# EAGLE design ukmarsbot-line-sensor-half-size-V2 (EAGLE 7.7.0)
CNAME: UKMARSBOT; CREVISION: v1.2; DESIGNER: Ian Butterworth
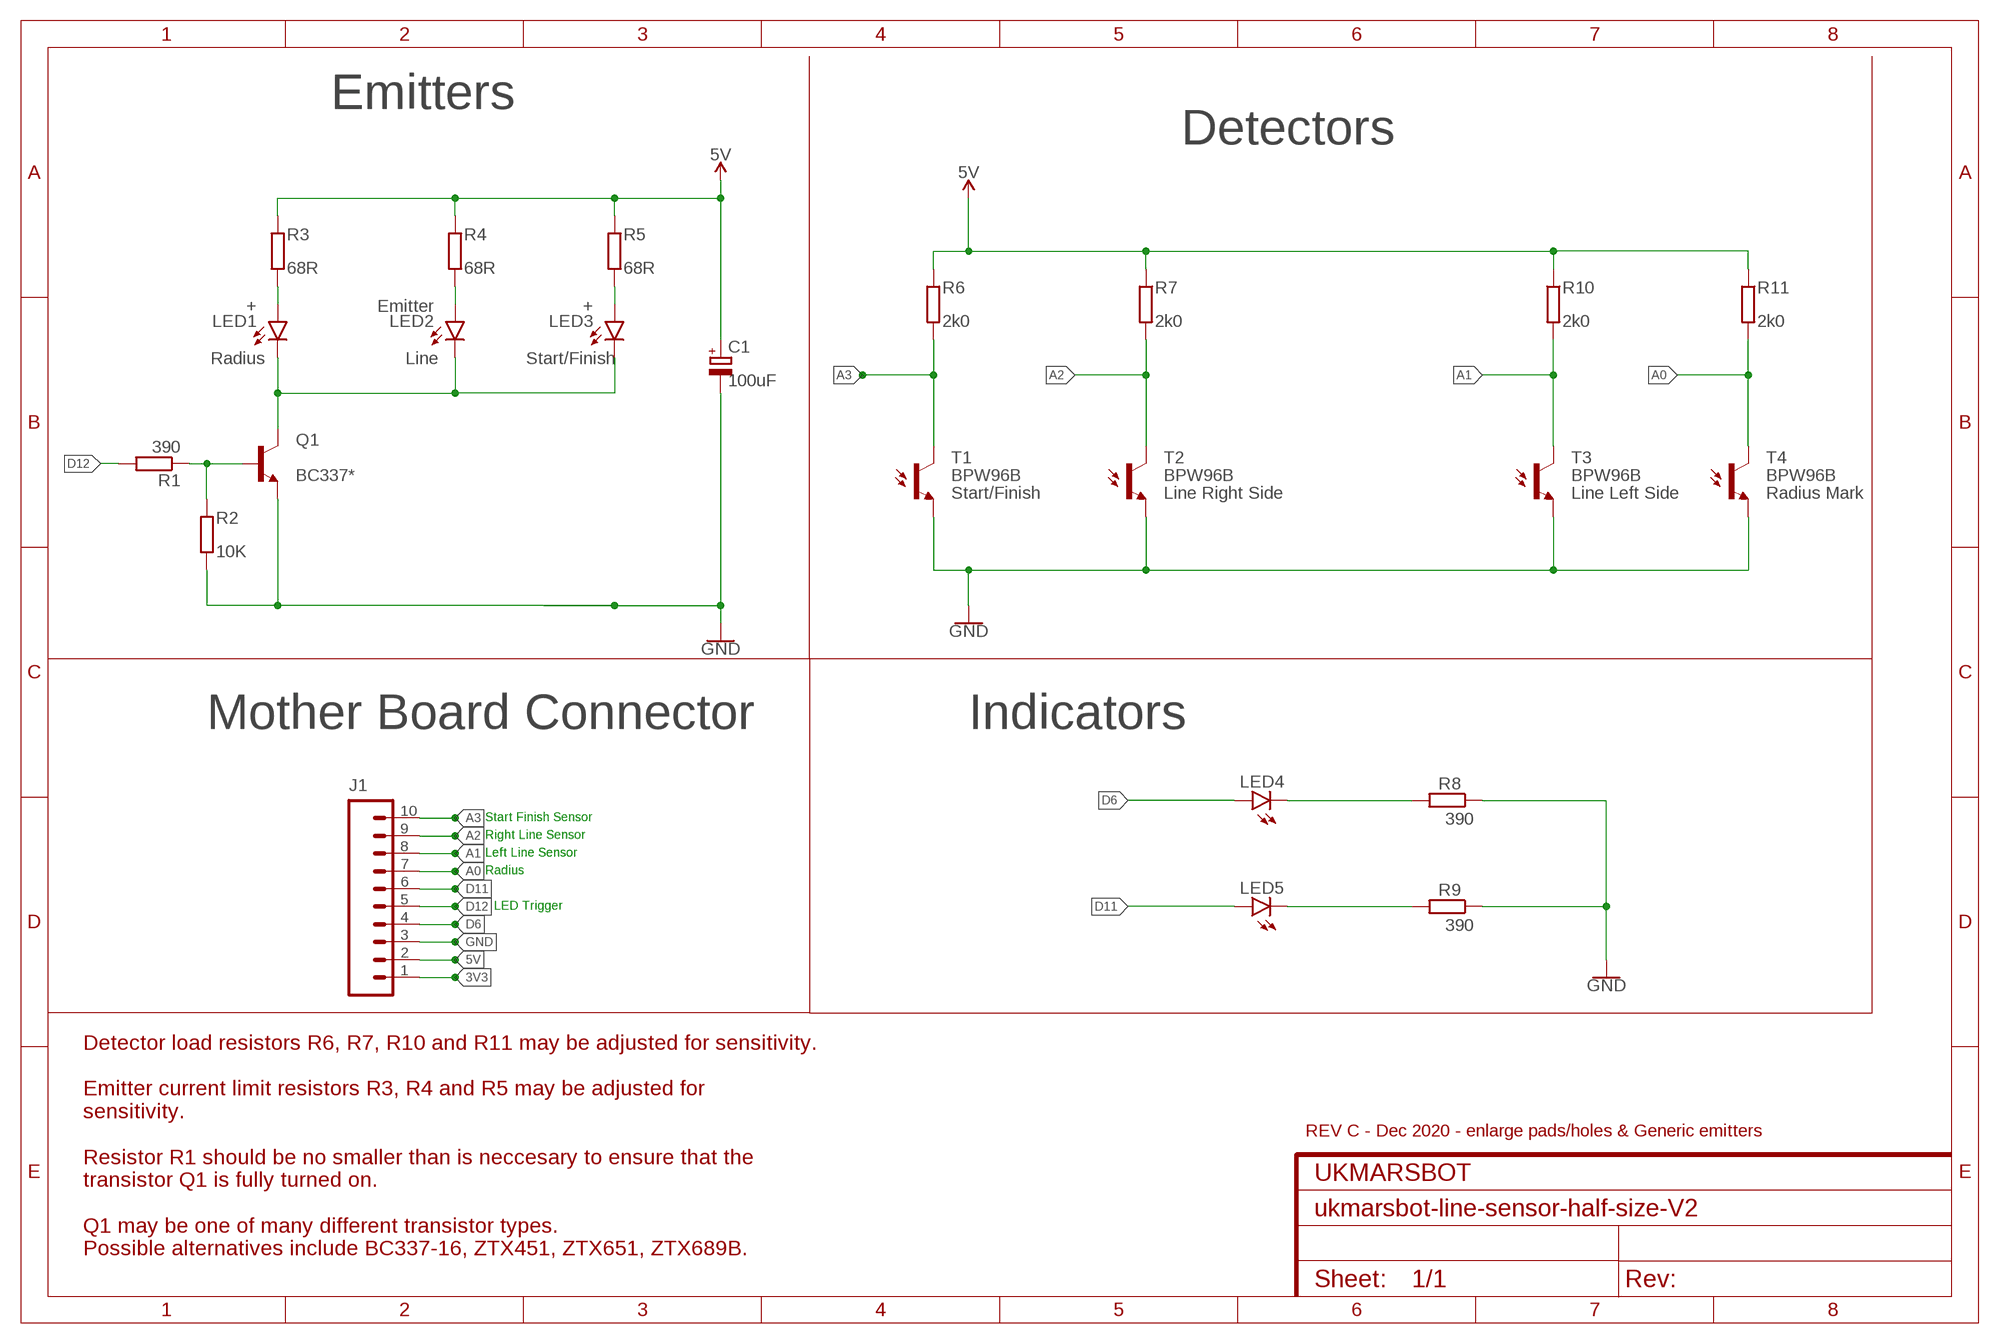
[diagram p0: schematic, sheet 1]

## Parts
C1  100uF  CPOL-EUE2.5-7  [E2,5-7]
J1  CONN_10"  [1X10]
LED1  +  LED5MM  [LED_5MM]
LED2  Emitter  LED5MM  [LED_5MM]
LED3  +  LED5MM  [LED_5MM]
LED4  LED3MM  [LED_3MM]
LED5  LED3MM  [LED_3MM]
Q1  BC337*  TRANS_NPN  [TO92-EBC]
R1  390  R-EU_0207/7  [0207/7]
R2  10K  R-EU_0207/7  [0207/7]
R3  68R  R-EU_0207/7  [0207/7]
R4  68R  R-EU_0207/7  [0207/7]
R5  68R  R-EU_0207/7  [0207/7]
R6  2k0  R-EU_0207/7  [0207/7]
R7  2k0  R-EU_0207/7  [0207/7]
R8  390  R-EU_0207/7  [0207/7]
R9  390  R-EU_0207/7  [0207/7]
R10  2k0  R-EU_0207/7  [0207/7]
R11  2k0  R-EU_0207/7  [0207/7]
T1  BPW96B  PHOTOTRANSISTOR5MM  [PHOTOTRANSISTOR_5MM]
T2  BPW96B  PHOTOTRANSISTOR5MM  [PHOTOTRANSISTOR_5MM]
T3  BPW96B  PHOTOTRANSISTOR5MM  [PHOTOTRANSISTOR_5MM]
T4  BPW96B  PHOTOTRANSISTOR5MM  [PHOTOTRANSISTOR_5MM]

## Nets
3V3: J1.1
5V [power]: C1.+ J1.2 R3.2 R4.2 R5.2 R6.1 R7.1 R10.1 R11.1
A0: J1.7 R11.2 T4.C
A1: J1.8 R10.2 T3.C
A2: J1.9 R7.2 T2.C
A3: J1.10 R6.2 T1.C
D6: J1.4 LED4.A
D11: J1.6 LED5.A
D12: J1.5 R1.2
GND [power]: C1.- J1.3 Q1.E R2.1 R8.1 R9.1 T1.E T2.E T3.E T4.E
N$1: Q1.B R1.1 R2.2
N$2 [emitters]: LED1.K(C) LED2.K(C) LED3.K(C) Q1.C
N$3: LED5.K(C) R9.2
N$4: LED4.K(C) R8.2
N$5 [emitters]: LED1.A R3.1
N$6 [emitters]: LED2.A R4.1
N$7 [emitters]: LED3.A R5.1

## Notes on the sheet
- Emitters
- Detectors
- Radius | Line | Start/Finish
- Start/Finish | Line Right Side | Line Left Side | Radius Mark
- Mother Board Connector | Indicators
- Start Finish Sensor
- Right Line Sensor
- Left Line Sensor
- Radius
- LED Trigger
- REV C - Dec 2020 - enlarge pads/holes & Generic emitters
- Detector load resistors R6, R7, R10 and R11 may be adjusted for sensitivity.
  
  Emitter current limit resistors R3, R4 and R5 may be adjusted for 
  sensitivity.
  
  Resistor R1 should be no smaller than is neccesary to ensure that the 
  transistor Q1 is fully turned on.
  
  Q1 may be one of many different transistor types. 
  Possible alternatives include BC337-16, ZTX451, ZTX651, ZTX689B.

## Library data of the parts
C1 = ukmarsbot:CPOL-EU: POLARIZED CAPACITOR, European symbol
J1 = ukmarsbot:CONN_10: Multi connection point. Often used as Generic Header-pin footprint for 0.1 inch spaced/style header connections On any of the 0.1 inch spaced packages, you can populate with these: Break Away Headers - Straight <https://www.sparkfun.com/products/116> (PRT-00116) Break Away Male Headers - Right Angle <https://www.sparkfun.com/products/553> (PRT-00553) Female Headers <https://www.sparkfun.com/products/115> (PRT-00115) Break Away Headers - Machine Pin <https://www.sparkfun.com/products/117> (PRT-00117) Break Away Female Headers - Swiss Machine Pin <https://www.sparkfun.com/products/743> (PRT-00743) Arduino Stackable Header - 10 Pin <https://www.sparkfun.com/products/11376> (PRT-11376) For SCREWTERMINALS and SPRING TERMINALS visit here: Screw Terimnals on SparkFun.com <https://www.sparkfun.com/search/results?term=Screw+Terminals> (5mm/3.5mm/2.54mm spacing) This device is also useful as a general connection point to wire up your design to another part of your project. Our various solder wires solder well into these plated through hole pads. Hook-Up Wire - Assortment (Stranded, 22 AWG) <https://www.sparkfun.com/products/11375> (PRT-11375) Hook-Up Wire - Assortment (Solid Core, 22 AWG) <https://www.sparkfun.com/products/11367> (PRT-11367) View the entire wire category on our website here <https://www.sparkfun.com/categories/141> Special notes: Molex polarized connector foot print use with SKU : PRT-08231 with associated crimp pins and housings. 1MM SMD Version SKU: PRT-10208 NOTES ON THE VARIANTS LOCK and LOCK_LONGPADS... This footprint was designed to help hold the alignment of a through-hole component (i.e. 6-pin header) while soldering it into place. You may notice that each hole has been shifted either up or down by 0.005 of an inch from it's more standard position (which is a perfectly straight line). This slight alteration caused the pins (the squares in the middle) to touch the edges of the holes. Because they are alternating, it causes a "brace" to hold the component in place. 0.005 has proven to be the perfect amount of "off-center" position when using our standard breakaway headers. Although looks a little odd when you look at the bare footprint, once you have a header in there, the alteration is very hard to notice. Also,if you push a header all the way into place, it is covered up entirely on the bottom side.; PROD_ID: CONN-11563
LED1-LED3 = ukmarsbot:LED: LED (Generic) Standard schematic elements and footprints for 5mm, 3mm, 1206, and 0603 sized LEDs. Generic LEDs with no color specified.
LED4 LED5 = ukmarsbot:LED: LED (Generic) Standard schematic elements and footprints for 5mm, 3mm, 1206, and 0603 sized LEDs. Generic LEDs with no color specified.; PROD_ID: DIO-08794
Q1 = ukmarsbot:TRANS_NPN: NPN transistor Current controlled devices typically used to amplify current or used as a switch. BC547 - COM-08928 <http://www.sparkfun.com/products/8928> (TO-92 45V 100mA) (1.Collector 2.Base 3.Emitter) 2N3904 - COM-00521 <http://www.sparkfun.com/products/521> (TO-92 40V 200mA) (1.Emitter 2.Base 3.Collector) P2N2222A - COM-12852 <http://www.sparkfun.com/products/12852> (TO-92 40V 600mA) (1.Collector 2.Base 3.Emitter)
R1-R11 = ukmarsbot:R-EU_: RESISTOR
T1-T4 = ukmarsbot:PHOTOTRANSISTOR: Phototransistor

## Net classes
0 default: width 0.406 mm
1 power: width 0.813 mm
2 emitters: width 0.61 mm

## Board
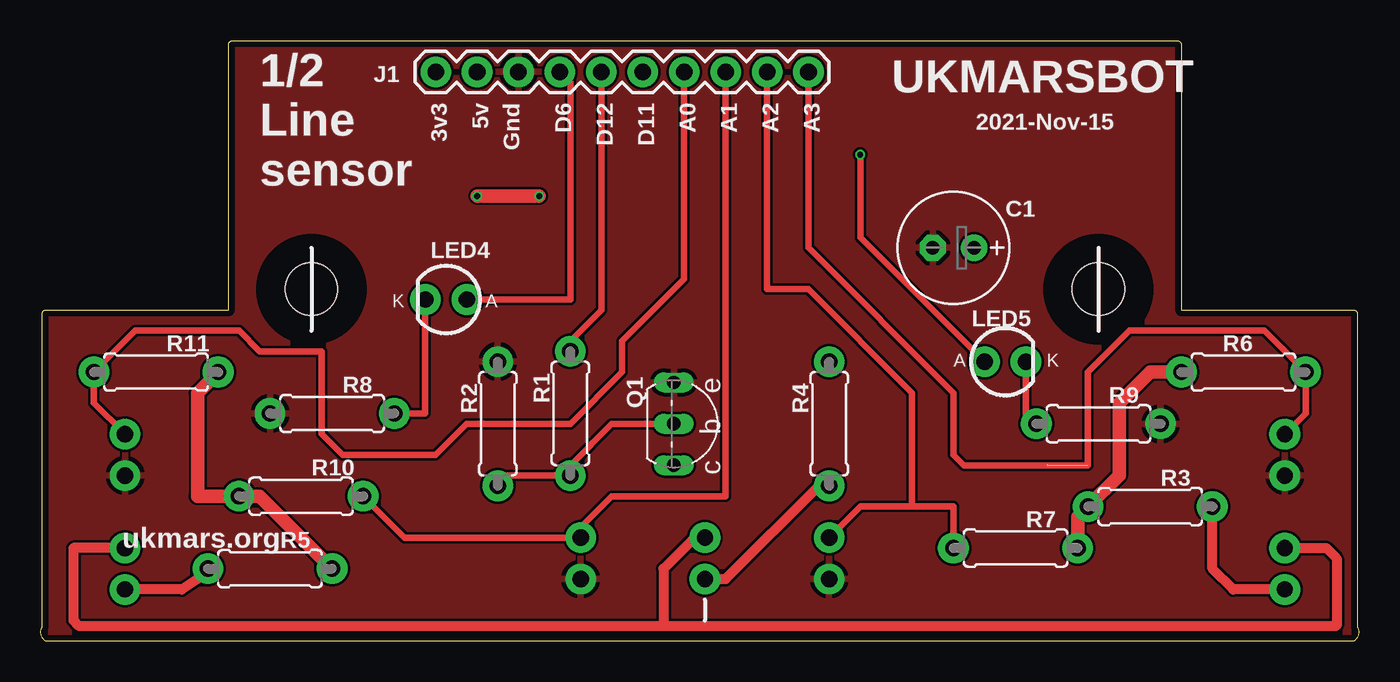
[diagram p1: board, top side]
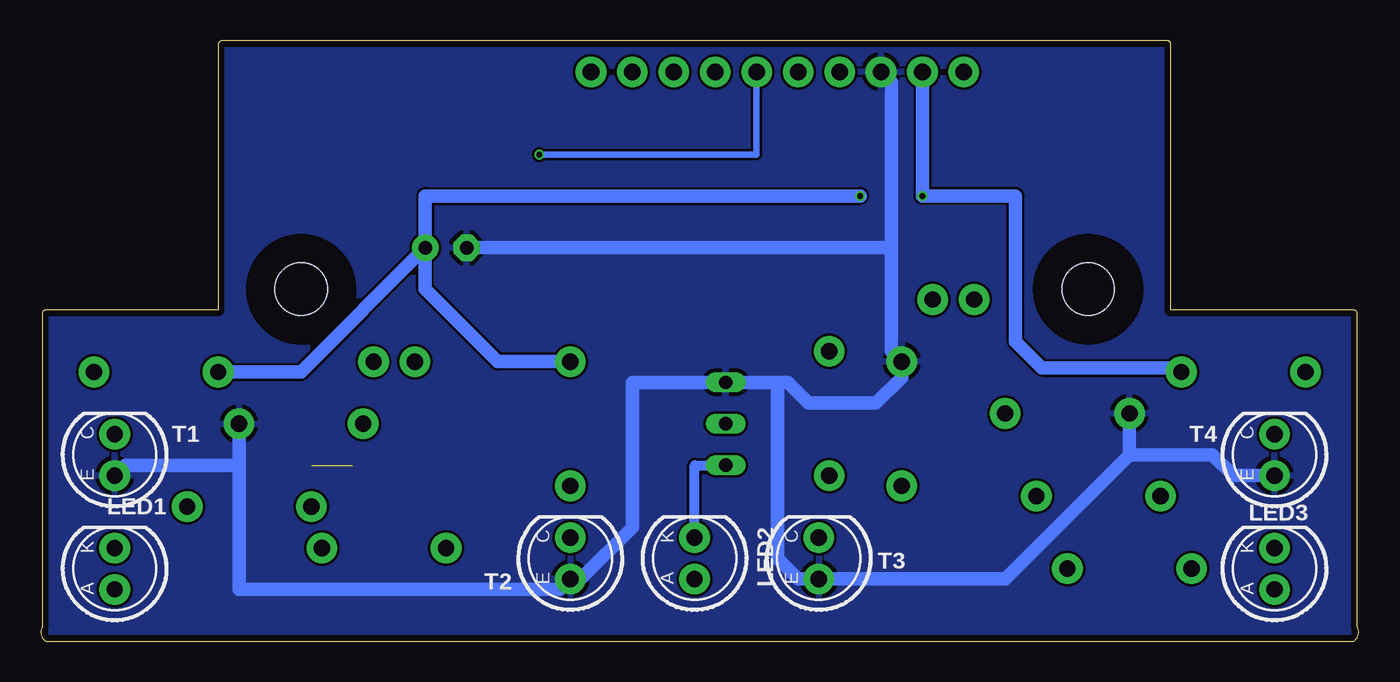
[diagram p2: board, bottom side, seen from below]

Size 80.82 x 36.83 mm. Coordinates in mm from the lower left corner, seen from the top.
Outline: 80.73,20.09 80.73,0.86 arc-90 80.5,0 0.32,0 arc-90 0.09,0.86 0.09,20.09 arc-90 0.32,20.32 11.52,20.32 11.52,36.6 arc-90 11.75,36.83 69.71,36.83 arc-90 69.94,36.6 69.94,20.32 80.5,20.32 arc-90 80.73,20.09
Copper layers (1*16): Top 0.035559375mm / dielectric 1.6mm / Bottom 0.035559375mm
Design rules "osh-park": minimum track width 6mil, minimum drill 10mil, track to track 6mil, track to pad 6mil, pad to pad 6mil, via to via 6mil, smd to smd 6mil, copper to edge 15mil, drill to drill 6mil, minimum pad ring 5mil, minimum via ring 5mil, stop-mask expansion 2.5mil, vias tented up to drill 0mil, thermal gap 10mil
Holes 3.2 mm at 16.6,21.59 64.86,21.59
tRestrict: area 13.4,18.4 to 19.8,24.8; area 61.7,18.4 to 68,24.8
bRestrict: area 13.4,18.4 to 19.8,24.8; area 61.7,18.4 to 68,24.8

### Footprints (pad centres in the part's own frame; a part is rotated, then mirrored left to right if it is on the bottom)
E2,5-7 = drill 0.813 pad 1.6: + -1.27,0 | drill 0.813 pad 1.6 octagon: - 1.27,0
1X10 = drill 1.016 pad 1.88: 1 0,0; 2 2.54,0; 3 5.08,0; 4 7.62,0; 5 10.16,0; 6 12.7,0; 7 15.24,0; 8 17.78,0; 9 20.32,0; 10 22.86,0
LED_5MM = drill 1 pad 1.88: A -1.27,0; K 1.27,0
LED_3MM = drill 1 pad 1.88: A -1.27,0; K 1.27,0
TO92-EBC = drill 0.813 long: B 0,-1.27; C 2.54,-1.27; E -2.54,-1.27
0207/7 = drill 1 pad 1.88: 1 -3.81,0; 2 3.81,0
PHOTOTRANSISTOR_5MM = drill 1 pad 1.88: C 1.27,0; E -1.27,0

### Placement (x,y rotation side)
C1  55.97,24.13 180 top
J1  24.22,34.93 0 top
LED1  76.29,4.45 90 bottom
LED2  40.73,5.08 90 bottom
LED3  5.17,4.45 90 bottom
LED4  24.85,20.95 180 top
LED5  59.14,17.14 0 top
Q1  40.09,13.33 270 top
R1  32.47,13.97 90 top
R2  28.03,13.33 270 top
R3  68.03,8.26 180 top
R4  48.35,13.33 90 top
R5  14.06,4.45 0 top
R6  73.75,16.51 0 top
R7  59.78,5.71 180 top
R8  17.87,13.97 0 top
R9  64.86,13.33 180 top
R10  15.96,8.89 0 top
R11  7.07,16.51 180 top
T1  76.29,11.43 90 bottom
T2  48.35,5.08 90 bottom
T3  33.11,5.08 90 bottom
T4  5.17,11.43 90 bottom

### Tracks (layer width: path | path; a pad name or v marks a point on that pad's centre or on a via)
5V  (via drill 0.35)
  Top 0.813: R6.1 68.03,16.51 66.13,14.61 66.13,10.16 R3.2 63.59,7.62 R7.1 | R5.2 13.42,8.89 R10.1 9.61,8.89 9.61,15.24 R11.1 | v30.57,27.3 v26.76,27.3
  Bottom 0.813: R4.2 52.79,17.14 57.24,21.59 C1.+ | C1.+ 64.86,16.51 R6.1 | J1.2 v26.76,27.3 21.04,27.3 21.04,18.38 19.42,16.76 11.13,16.76 R11.1 | v30.57,27.3 57.24,27.3 C1.+
A0
  Top 0.406: T4.C 3.26,14.61 R11.2 5.8,19.05 12.15,19.05 13.42,17.78 17.23,17.78 17.23,12.7 18.5,11.43 24.22,11.43 26.12,13.33 32.47,13.33 35.65,16.51 35.65,18.41 39.46,22.22 J1.7
A1
  Top 0.406: R10.2 22.31,6.35 T3.C 33.11,6.98 35.01,8.89 42,8.89 J1.8
A2
  Top 0.406: R7.2 55.97,8.26 53.43,8.26 | 53.43,8.26 50.25,8.26 T2.C | 53.43,8.26 53.43,15.24 47.08,21.59 44.54,21.59 J1.9
A3  (1 unrouted)
  Top 0.406: T1.C 77.56,13.97 R6.2 75.02,19.05 66.76,19.05 64.22,16.51 64.22,10.79 56.6,10.79 55.97,11.43 55.97,15.24 47.08,24.13 J1.10 | 61.68,10.79 60.41,10.79
D6
  Top 0.406: J1.4 32.47,34.29 32.47,20.95 LED4.A
D11  (via drill 0.35)
  Top 0.406: v50.25,29.84 50.25,24.77 LED5.A
  Bottom 0.406: v50.25,29.84 36.92,29.84 J1.6
D12
  Top 0.406: R1.2 32.47,18.41 34.38,20.32 J1.5
GND
  Bottom 0.813: T1.E 75.65,10.79 68.67,10.79 | T4.E 7.71,10.16 8.98,11.43 14.06,11.43 | 14.06,11.43 21.68,3.81 T3.E 34.38,3.81 35.65,5.08 35.65,15.88 | R8.1 14.06,11.43 | R9.1 68.67,10.79 | 68.67,10.79 68.67,3.17 48.98,3.17 T2.E 47.71,3.81 44.54,6.98 44.54,15.88 Q1.E 35.65,15.88 | C1.- 28.66,24.13 | J1.3 28.66,34.29 28.66,24.13 | 28.66,24.13 28.66,17.78 R2.1 28.03,16.19 29.61,14.61 33.74,14.61 35.01,15.88 35.65,15.88
  pour Top: 0.09,0 0.09,20.32 11.52,20.32 11.52,36.83 69.94,36.83 69.94,20.32 80.73,20.32 80.73,0
  pour Bottom: 0.09,0 0.09,20.32 11.47,20.32 11.28,36.83 69.7,36.83 69.89,20.32 80.73,20.32 80.73,0
N$1
  Top 0.406: R2.2 28.66,10.16 R1.1 32.47,10.79 35.01,13.33 Q1.B
N$2
  Top 0.61: 38.19,0.95 2.31,0.95 1.99,1.27 1.99,5.71 LED3.K | 38.19,0.95 79.46,0.95 79.46,5.08 78.83,5.71 LED1.K | LED2.K 40.09,6.35 38.19,4.45 38.19,0.95
  Bottom 0.61: Q1.C 40.73,10.79 LED2.K
N$3
  Top 0.406: LED5.K 60.41,13.97 R9.2
N$4
  Top 0.406: LED4.K 23.58,13.97 R8.2
N$5
  Top 0.61: LED1.A 73.11,3.17 71.84,4.45 R3.1
N$6
  Top 0.61: R4.1 47.71,9.53 42,3.81 LED2.A
N$7
  Top 0.61: R5.1 9.61,3.81 8.66,3.17 LED3.A

### Text on the board
tPlace: UKMARSBOT | 2021-Nov-15 | 1/2 / Line / sensor | ukmars.org
tNames: 3v3 | 5v | Gnd | D6 | D12 | D11 | A0 | A1 | A2 | A3